# Altium schematic sheet power.SCHDOC
size B; PageSetup: Record=PageOptions|CenterHorizontal=True|CenterVertical=True|PrintScale=1.09|XCorrection=1.00|YCorrection=1.00|PrintKind=1|BorderSize=5000000|LeftOffset=0|BottomOffset=0|Orientation=2|PaperLength=1000|PaperWidth=1000|Scale=100|PaperSource=15|PrintQuality=600|MediaType=1|DitherType=10|PaperKind=11x17|PrintScaleMode=1
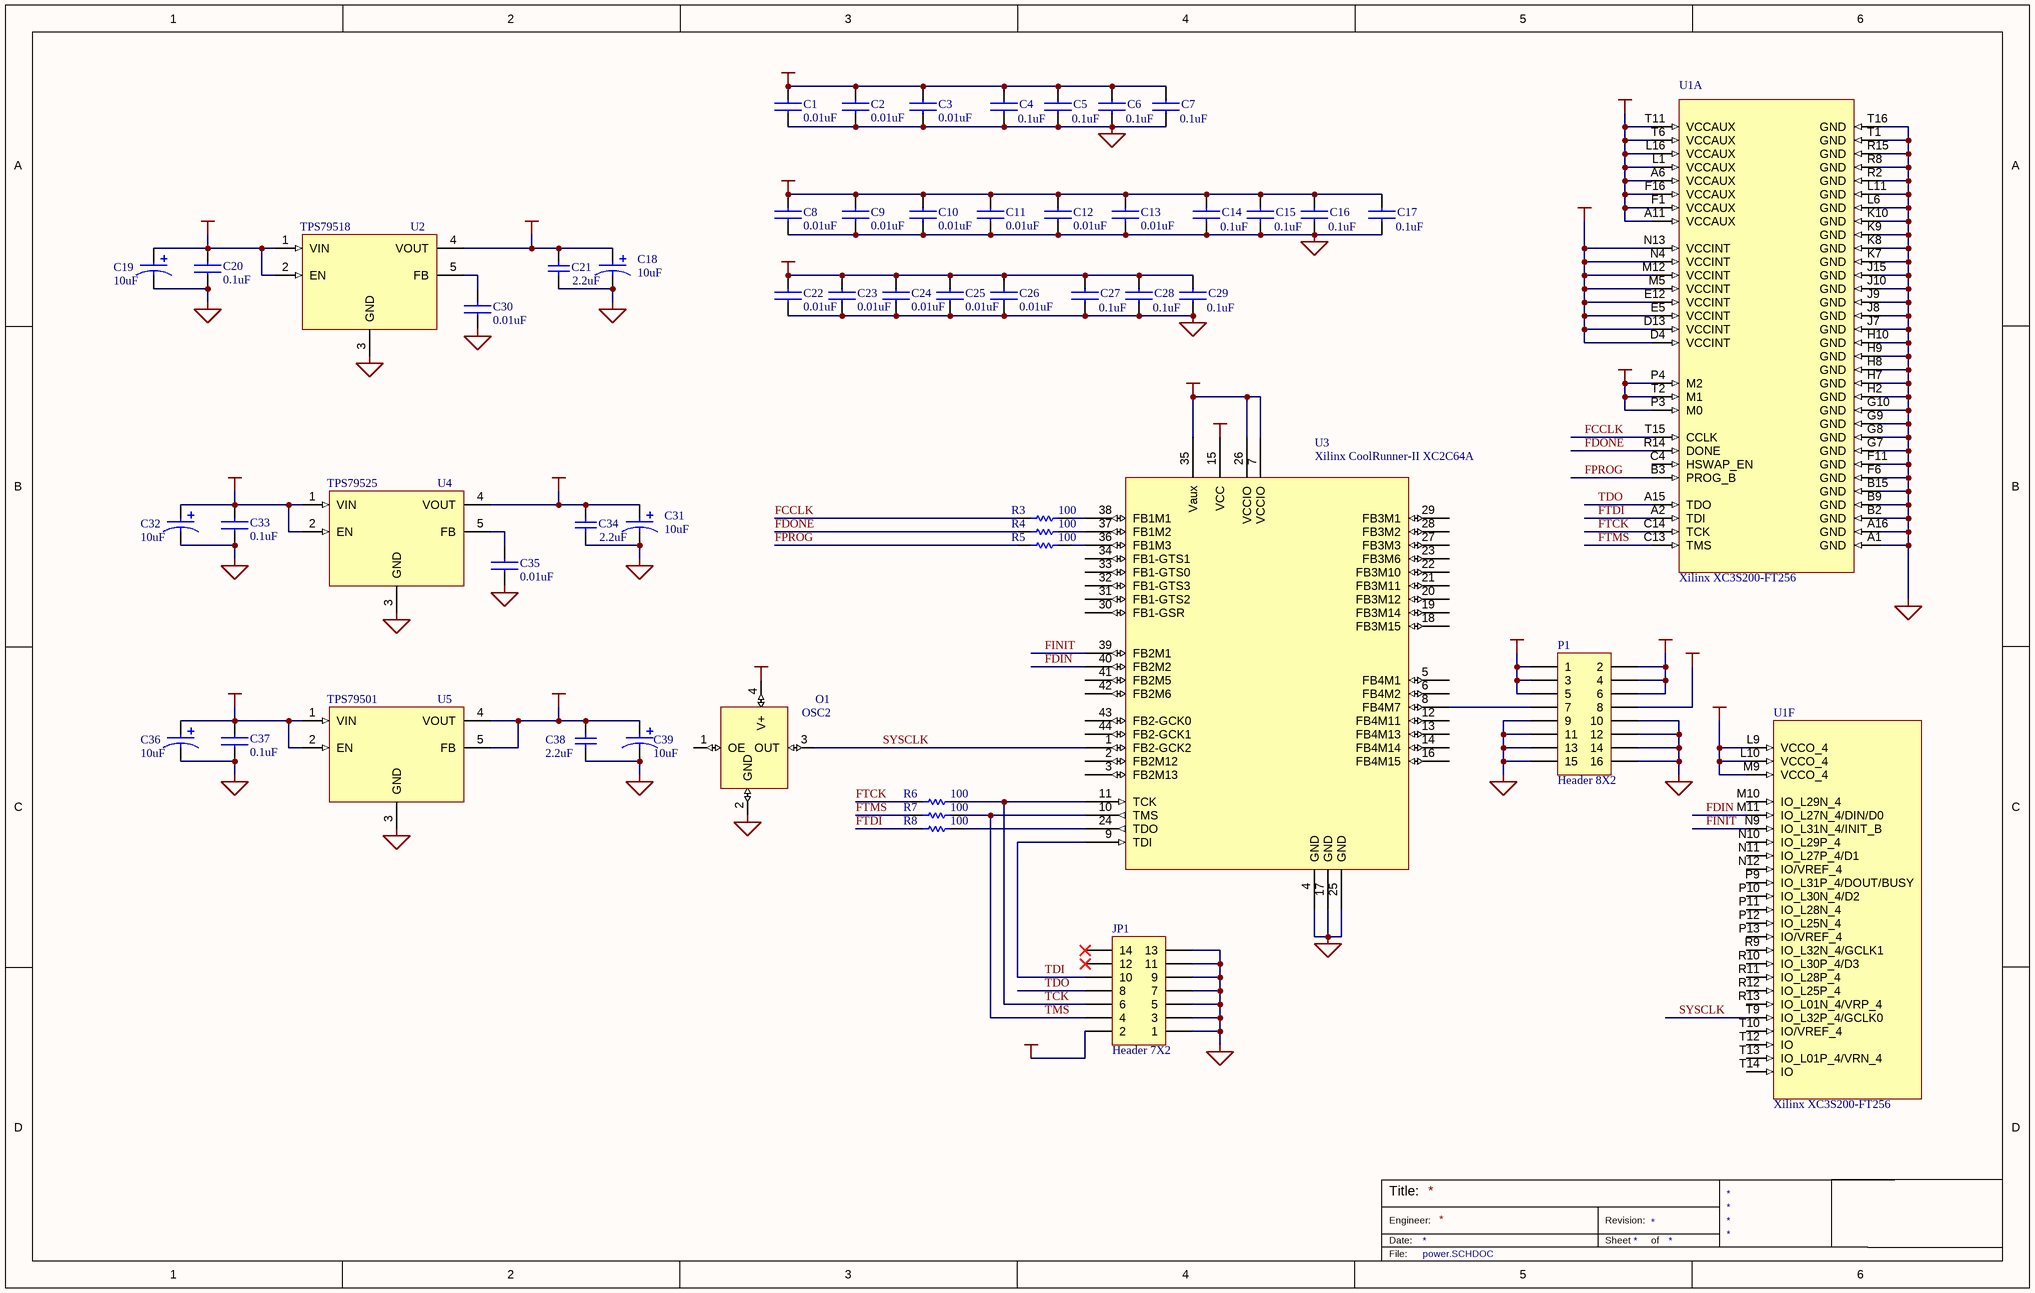
[diagram p0: power.SCHDOC]

## Parts
C1  value 0.01uF  [0402]  (hidden comment: CAPACITOR)
C2  value 0.01uF  [0402]  (hidden comment: CAPACITOR)
C3  value 0.01uF  [0402]  (hidden comment: CAPACITOR)
C4  value 0.1uF  [0603]  (hidden comment: CAPACITOR)
C5  value 0.1uF  [0603]  (hidden comment: CAPACITOR)
C6  value 0.1uF  [0603]  (hidden comment: CAPACITOR)
C7  value 0.1uF  [0603]  (hidden comment: CAPACITOR)
C8  value 0.01uF  [0402]  (hidden comment: CAPACITOR)
C9  value 0.01uF  [0402]  (hidden comment: CAPACITOR)
C10  value 0.01uF  [0402]  (hidden comment: CAPACITOR)
C11  value 0.01uF  [0402]  (hidden comment: CAPACITOR)
C12  value 0.01uF  [0402]  (hidden comment: CAPACITOR)
C13  value 0.01uF  [0402]  (hidden comment: CAPACITOR)
C14  value 0.1uF  [0603]  (hidden comment: CAPACITOR)
C15  value 0.1uF  [0603]  (hidden comment: CAPACITOR)
C16  value 0.1uF  [0603]  (hidden comment: CAPACITOR)
C17  value 0.1uF  [0603]  (hidden comment: CAPACITOR)
C18  value 10uF  [6032]  (hidden comment: POLCAP2)
C19  value 10uF  [6032]  (hidden comment: POLCAP2)
C20  value 0.1uF  [0603]  (hidden comment: CAPACITOR)
C21  value 2.2uF  [1206]  (hidden comment: Cap)
C22  value 0.01uF  [0402]  (hidden comment: CAPACITOR)
C23  value 0.01uF  [0402]  (hidden comment: CAPACITOR)
C24  value 0.01uF  [0402]  (hidden comment: CAPACITOR)
C25  value 0.01uF  [0402]  (hidden comment: CAPACITOR)
C26  value 0.01uF  [0402]  (hidden comment: CAPACITOR)
C27  value 0.1uF  [0603]  (hidden comment: CAPACITOR)
C28  value 0.1uF  [0603]  (hidden comment: CAPACITOR)
C29  value 0.1uF  [0603]  (hidden comment: CAPACITOR)
C30  value 0.01uF  [0402]  (hidden comment: CAPACITOR)
C31  value 10uF  [6032]  (hidden comment: POLCAP2)
C32  value 10uF  [6032]  (hidden comment: POLCAP2)
C33  value 0.1uF  [0603]  (hidden comment: CAPACITOR)
C34  value 2.2uF  [1206]  (hidden comment: Cap)
C35  value 0.01uF  [0402]  (hidden comment: CAPACITOR)
C36  value 10uF  [6032]  (hidden comment: POLCAP2)
C37  value 0.1uF  [0603]  (hidden comment: CAPACITOR)
C38  value 2.2uF  [1206]  (hidden comment: Cap)
C39  value 10uF  [6032]  (hidden comment: POLCAP2)
JP1  Header 7X2  [SMT 2x7 2mm HDR]
O1  OSC2  [ECS-3953M]
P1  Header 8X2  [MOLEX 15-91-2160]
R3  value 100  [CC1608-0603]  (hidden comment: current-limiting series res)
R4  value 100  [CC1608-0603]  (hidden comment: current-limiting series res)
R5  value 100  [CC1608-0603]  (hidden comment: current-limiting series res)
R6  value 100  [CC1608-0603]  (hidden comment: current-limiting series res)
R7  value 100  [CC1608-0603]  (hidden comment: current-limiting series res)
R8  value 100  [CC1608-0603]  (hidden comment: current-limiting series res)
U1  Xilinx XC3S200-FT256  [Xilinx FT256 BGA]  (parts A,F of 9)
U2  TPS79518  [SOT223-5/Simple]
U3  Xilinx CoolRunner-II XC2C64A  [QFP10x10-G44/G10N]
U4  TPS79525  [SOT223-5/Simple]
U5  TPS79501  [SOT223-5/Simple]

## Nets
+1.2VCC: C1.1 C2.1 C3.1 C4.1 C5.1 C6.1 C7.1 C38.2 C39.1 U1.D4(VCCINT) U1.D13(VCCINT) U1.E5(VCCINT) U1.E12(VCCINT) U1.M5(VCCINT) U1.M12(VCCINT) U1.N4(VCCINT) U1.N13(VCCINT) U5.4(VOUT) U5.5(FB)
+1.8VCC: C18.1 C21.2 U2.4(VOUT) U3.15(VCC)
+2.5VCC: C8.1 C9.1 C10.1 C11.1 C12.1 C13.1 C14.1 C15.1 C16.1 C17.1 C31.1 C34.2 U1.A6(VCCAUX) U1.A11(VCCAUX) U1.F1(VCCAUX) U1.F16(VCCAUX) U1.L1(VCCAUX) U1.L16(VCCAUX) U1.T6(VCCAUX) U1.T11(VCCAUX) U4.4(VOUT)
+5VCC: P1.2 P1.4 P1.6
+12VCC: P1.8
GND: C1.2 C2.2 C3.2 C4.2 C5.2 C6.2 C7.2 C8.2 C9.2 C10.2 C11.2 C12.2 C13.2 C14.2 C15.2 C16.2 C17.2 C18.2 C19.2 C20.1 C21.1 C22.2 C23.2 C24.2 C25.2 C26.2 C27.2 C28.2 C29.2 C30.1 C31.2 C32.2 C33.1 C34.1 C35.1 C36.2 C37.1 C38.1 C39.2 JP1.1 JP1.3 JP1.5 JP1.7 JP1.9 JP1.11 JP1.13 O1.2(GND) P1.9 P1.10 P1.11 P1.12 P1.13 P1.14 P1.15 P1.16 U1.A1(GND) U1.A16(GND) U1.B2(GND) U1.B9(GND) U1.B15(GND) U1.F6(GND) U1.F11(GND) U1.G7(GND) U1.G8(GND) U1.G9(GND) U1.G10(GND) U1.H2(GND) U1.H7(GND) U1.H8(GND) U1.H9(GND) U1.H10(GND) U1.J7(GND) U1.J8(GND) U1.J9(GND) U1.J10(GND) U1.J15(GND) U1.K7(GND) U1.K8(GND) U1.K9(GND) U1.K10(GND) U1.L6(GND) U1.L11(GND) U1.R2(GND) U1.R8(GND) U1.R15(GND) U1.T1(GND) U1.T16(GND) U2.3(GND) U3.4(GND) U3.17(GND) U3.25(GND) U4.3(GND) U5.3(GND)
VCC: C19.1 C20.2 C22.1 C23.1 C24.1 C25.1 C26.1 C27.1 C28.1 C29.1 C32.1 C33.2 C36.1 C37.2 JP1.2 O1.4(V+) P1.1 P1.3 P1.5 U1.L9(VCCO_4) U1.L10(VCCO_4) U1.M9(VCCO_4) U1.P3(M0) U1.P4(M2) U1.T2(M1) U2.1(VIN) U2.2(EN) U3.7(VCCIO) U3.26(VCCIO) U3.35(Vaux) U4.1(VIN) U4.2(EN) U5.1(VIN) U5.2(EN)
FCCLK: R3.2 U1.T15(CCLK)
FDIN: U1.M11(IO_L27N_4/DIN/D0) U3.40(FB2M2)
FDONE: R4.2 U1.R14(DONE)
FINIT: U1.N9(IO_L31N_4/INIT_B) U3.39(FB2M1)
FPROG: R5.2 U1.B3(PROG_B)
FTCK: R6.2 U1.C14(TCK)
FTDI: R8.2 U1.A2(TDI)
FTMS: R7.1 U1.C13(TMS)
SYSCLK: O1.3(OUT) U1.T9(IO_L32P_4/GCLK0) U3.1(FB2-GCK2)
TCK: JP1.6 R6.1 U3.11(TCK)
TDI: JP1.10 U3.9(TDI)
TDO: JP1.8 U1.A15(TDO)
TMS: JP1.4 R7.2 U3.10(TMS)
NetC30_2: C30.2 U2.5(FB)
NetC35_2: C35.2 U4.5(FB)
NetP1_7: P1.7 U3.8(FB4M7)
NetR3_1: R3.1 U3.38(FB1M1)
NetR4_1: R4.1 U3.37(FB1M2)
NetR5_1: R5.1 U3.36(FB1M3)
NetR8_1: R8.1 U3.24(TDO)

Not connected (* = marked no-connect by the designer): JP1 12* 14*; O1 1(OE); U1 C4(HSWAP_EN) M10(IO_L29N_4) N10(IO_L29P_4) N11(IO_L27P_4/D1) N12(IO/VREF_4) P9(IO_L31P_4/DOUT/BUSY) P10(IO_L30N_4/D2) P11(IO_L28N_4) P12(IO_L25N_4) P13(IO/VREF_4) R9(IO_L32N_4/GCLK1) R10(IO_L30P_4/D3) R11(IO_L28P_4) R12(IO_L25P_4) R13(IO_L01N_4/VRP_4) T10(IO/VREF_4) T12(IO) T13(IO_L01P_4/VRN_4) T14(IO); U3 2(FB2M12) 3(FB2M13) 5(FB4M1) 6(FB4M2) 12(FB4M11) 13(FB4M13) 14(FB4M14) 16(FB4M15) 18(FB3M15) 19(FB3M14) 20(FB3M12) 21(FB3M11) 22(FB3M10) 23(FB3M6) 27(FB3M3) 28(FB3M2) 29(FB3M1) 30(FB1-GSR) 31(FB1-GTS2) 32(FB1-GTS3) 33(FB1-GTS0) 34(FB1-GTS1) 41(FB2M5) 42(FB2M6) 43(FB2-GCK0) 44(FB2-GCK1)

## Notes on the sheet
- Title:
- Engineer:
- Date:
- Revision:
- Sheet
- of
- File:

## Library data of the parts
C1-C17 C22-C29 = CAPACITOR: Standard Capacitor; Type: X7R
C18 C19 C31 C32 C36 C39 = POLCAP2: Standard Capacitor
C20 C30 C33 C35 C37 = CAPACITOR: Standard Capacitor
C21 C34 C38 = Cap: Capacitor; Manufacturer: Generic Components; Class I: Passive; Published: 8-Jun-2000; Revision: July-2002: Re-released for DXP Platform.; Publisher: Altium Limited; Class II: Capacitor
JP1 = Header 7X2: Header, 7-Pin, Dual row; Manufacturer: Generic Components; Class I: Connector; Revision: July-2002: Re-released for DXP Platform.; Publisher: Altium Limited
O1 = OSC2: ECS SMD Oscillator, ECS-3953M
P1 = Header 8X2: Header, 8-Pin, Dual row; LatestRevisionDate: 17-Jul-2002; LatestRevisionNote: Re-released for DXP Platform.; Publisher: Altium Limited
R3-R8 = Res1: Resistor; Manufacturer: Generic Components; Class I: Passive; Tolerance: 1%; Published: 8-Jun-2000; Revision: July-2002: Re-released for DXP Platform.; Publisher: Altium Limited; Class II: Resistor
U1 = XC3S200-FT256: Xilinx Spartan-3 FPGA
U2 U4 U5 = TPS795XX: TI Ultra-low-noise LDO
U3 = XC2C64A-5VQ44C